# EAGLE design untitled2 (EAGLE 7.2.0)
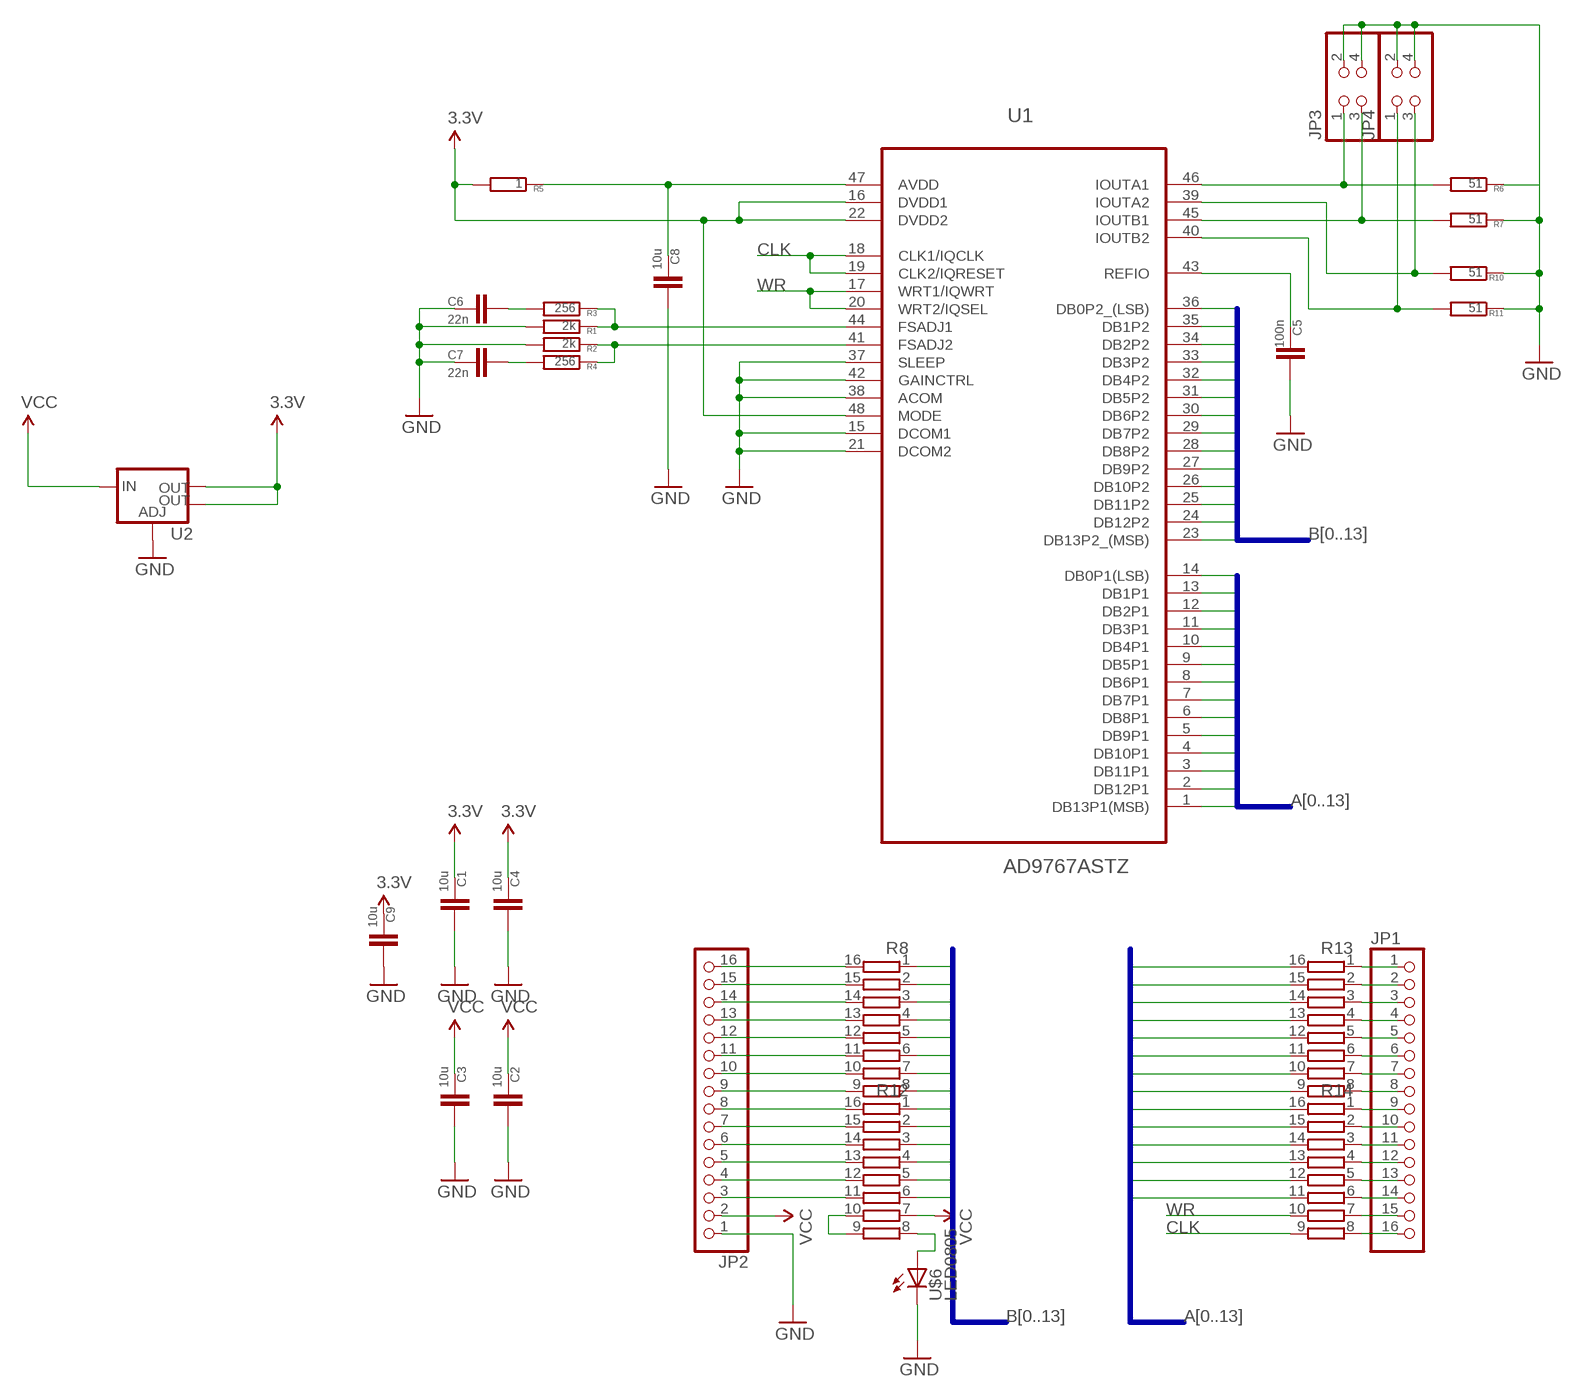
[diagram p0: schematic, sheet 1]

## Parts
C1  10u  CC0805  [C0805]
C2  10u  CC0805  [C0805]
C3  10u  CC0805  [C0805]
C4  10u  CC0805  [C0805]
C5  100n  CC0805  [C0805]
C6  22n  CC0805  [C0805]
C7  22n  CC0805  [C0805]
C8  10u  CC0805  [C0805]
C9  10u  CC0805  [C0805]
JP1  PINHD-1X16_2.54  [1X16]
JP2  PINHD-1X16_2.54  [1X16]
JP3  PINHD-2X02_2.54-SMD  [2X02SMD]
JP4  PINHD-2X02_2.54-SMD  [2X02SMD]
R1  2k  R0805  [R0805]
R2  2k  R0805  [R0805]
R3  256  R0805  [R0805]
R4  256  R0805  [R0805]
R5  1  R0603  [0603]
R6  51  R0805  [R0805]
R7  51  R0805  [R0805]
R8  4816P-T01  [4816P]
R10  51  R0805  [R0805]
R11  51  R0805  [R0805]
R12  4816P-T01  [4816P]
R13  4816P-T01  [4816P]
R14  4816P-T01  [4816P]
U1  AD9767ASTZ  [QFP50P900X900X160-48N]
U2  V_REG_LM1117SOT223  [SOT223]
U$6  LED0805  [0805-LED]

## Nets
3.3V: C1.2 C4.2 C9.2 R5.2 U1.16(DVDD1) U1.22(DVDD2) U1.48(MODE) U2.2(OUT) U2.4(OUT)
A0: R14.11 U1.14(DB0P1(LSB))
A1: R14.12 U1.13(DB1P1)
A2: R14.13 U1.12(DB2P1)
A3: R14.14 U1.11(DB3P1)
A4: R14.15 U1.10(DB4P1)
A5: R14.16 U1.9(DB5P1)
A6: R13.9 U1.8(DB6P1)
A7: R13.10 U1.7(DB7P1)
A8: R13.11 U1.6(DB8P1)
A9: R13.12 U1.5(DB9P1)
A10: R13.13 U1.4(DB10P1)
A11: R13.14 U1.3(DB11P1)
A12: R13.15 U1.2(DB12P1)
A13: R13.16 U1.1(DB13P1(MSB))
B0: R8.1 U1.36(DB0P2_(LSB))
B1: R8.2 U1.35(DB1P2)
B2: R8.3 U1.34(DB2P2)
B3: R8.4 U1.33(DB3P2)
B4: R8.5 U1.32(DB4P2)
B5: R8.6 U1.31(DB5P2)
B6: R8.7 U1.30(DB6P2)
B7: R8.8 U1.29(DB7P2)
B8: R12.1 U1.28(DB8P2)
B9: R12.2 U1.27(DB9P2)
B10: R12.3 U1.26(DB10P2)
B11: R12.4 U1.25(DB11P2)
B12: R12.5 U1.24(DB12P2)
B13: R12.6 U1.23(DB13P2_(MSB))
CLK: R14.9 U1.18(CLK1/IQCLK) U1.19(CLK2/IQRESET)
GND: C1.1 C2.1 C3.1 C4.1 C5.1 C6.2 C7.2 C8.1 C9.1 JP2.1 JP3.2 JP3.4 JP4.2 JP4.4 R1.2 R2.2 R6.1 R7.1 R10.1 R11.1 U1.15(DCOM1) U1.21(DCOM2) U1.37(SLEEP) U1.38(ACOM) U1.42(GAINCTRL) U2.1(ADJ) U$6.C
N$1: JP1.1 R13.1
N$3: JP1.2 R13.2
N$4: JP1.3 R13.3
N$7: JP1.4 R13.4
N$8: JP1.5 R13.5
N$9: JP1.6 R13.6
N$10: C8.2 R5.1 U1.47(AVDD)
N$11: C6.1 R3.2
N$12: C7.1 R4.2
N$13: JP1.7 R13.7
N$15: JP1.8 R13.8
N$16: JP1.9 R14.1
N$17: R1.1 R3.1 U1.44(FSADJ1)
N$18: C5.2 U1.43(REFIO)
N$19: R2.1 R4.1 U1.41(FSADJ2)
N$20: JP1.10 R14.2
N$21: JP1.11 R14.3
N$22: JP1.12 R14.4
N$23: JP1.13 R14.5
N$24: JP1.14 R14.6
N$25: JP1.15 R14.7
N$26: JP1.16 R14.8
N$27: JP2.16 R8.16
N$28: JP2.15 R8.15
N$30: R12.8 U$6.A
N$31: JP2.14 R8.14
N$32: JP2.13 R8.13
N$33: JP2.12 R8.12
N$34: JP2.11 R8.11
N$35: JP2.10 R8.10
N$36: JP2.9 R8.9
N$37: JP2.8 R12.16
N$38: JP2.7 R12.15
N$39: JP2.6 R12.14
N$40: JP2.5 R12.13
N$41: JP2.4 R12.12
N$42: JP2.3 R12.11
N$43: R12.9 R12.10
O1N: JP3.3 R7.2 U1.45(IOUTB1)
O1P: JP3.1 R6.2 U1.46(IOUTA1)
O2N: JP4.1 R11.2 U1.40(IOUTB2)
O2P: JP4.3 R10.2 U1.39(IOUTA2)
VCC: C2.2 C3.2 JP2.2 R12.7 U2.3(IN)
WR: R14.10 U1.17(WRT1/IQWRT) U1.20(WRT2/IQSEL)

## Buses
B[0..13]
A[0..13]

## Library data of the parts
C1-C9 = smalsmd:C: Capacitor
JP1 JP2 = pinhead-2:PINHD-1X16: PIN HEADER
JP3 JP4 = pinhead-2:PINHD-2X02: PIN HEADER
R1-R7 R10 R11 = smalsmd:R
R8 R12-R14 = resistor-bourns:4816P-T01: BOURNS RESISTOR NETWORK; MF: BOURNS, INC.; MPN: 4816P-T01-684LF; OC_FARNELL: 9357483; OC_NEWARK: 33K0707
U1 = Analog Devices_By_element14_Batch_1:AD9767ASTZ: Digital-to-Analog Converter; MPN: AD9767ASTZ; OC_FARNELL: -; OC_NEWARK: 59K7411; PACKAGE: QFP-48; SUPPLIER: ANALOG DEVICES
U2 = SparkFun-PowerIC:V_REG_LM1117: Voltage Regulator LM1117 Standard adjustable voltage regulator but in SMD form. Spark Fun Electronics SKU : COM-00595; PROD_ID: VREG-08170
U$6 = smalsmd:LED

## Board
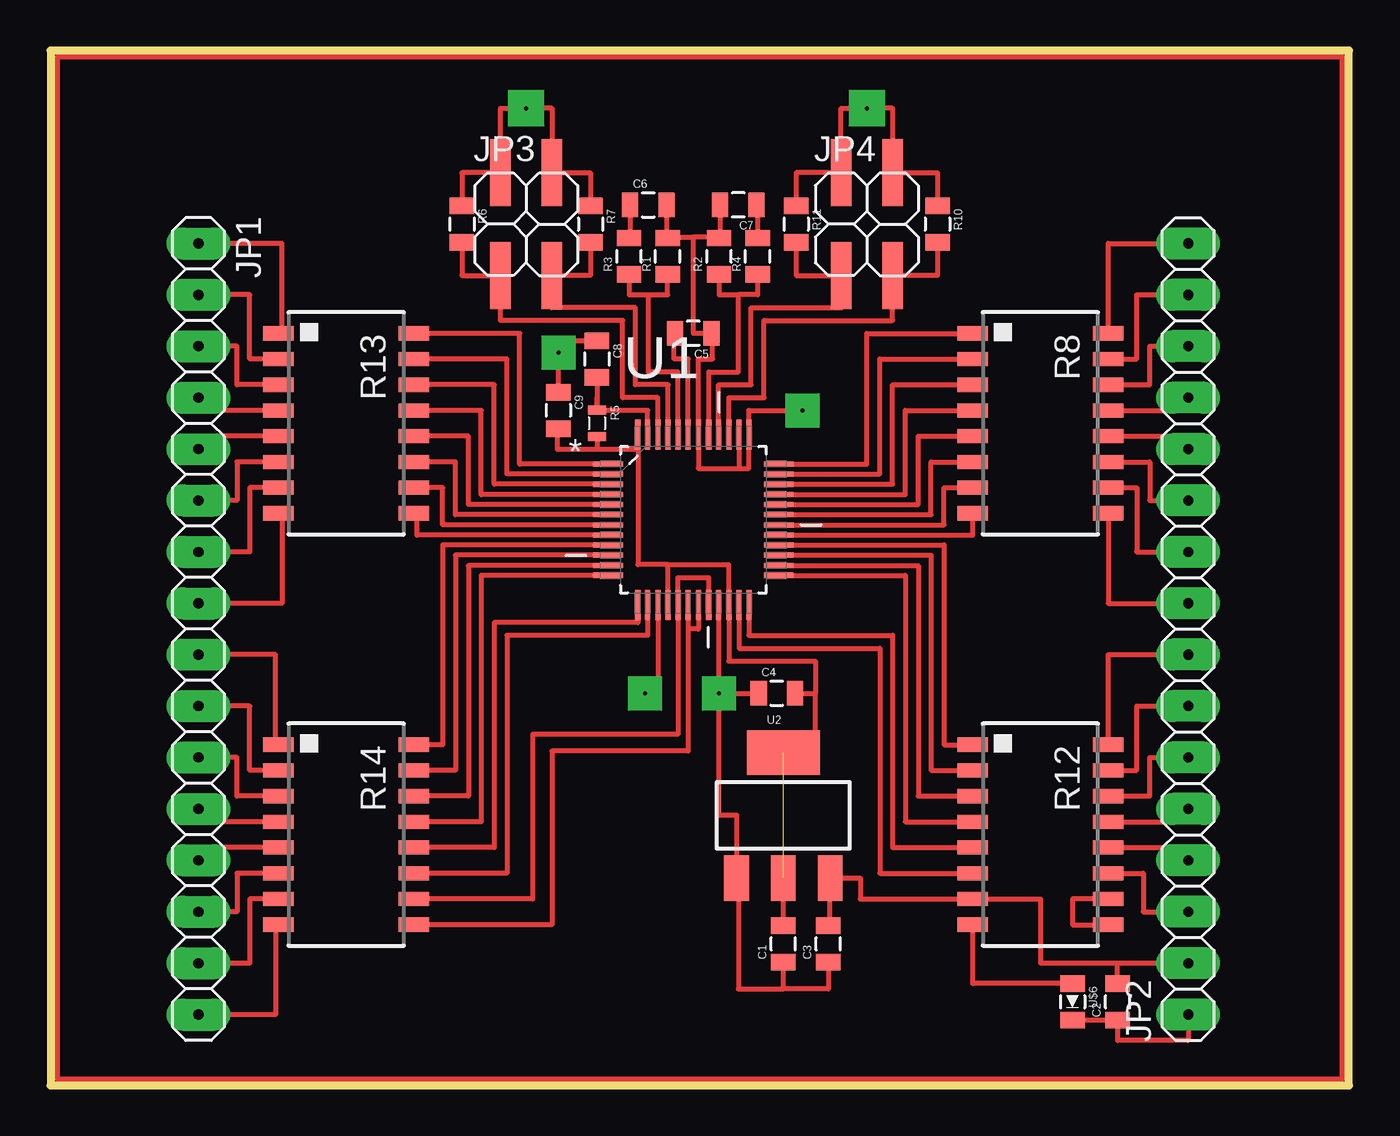
[diagram p1: board, top side]
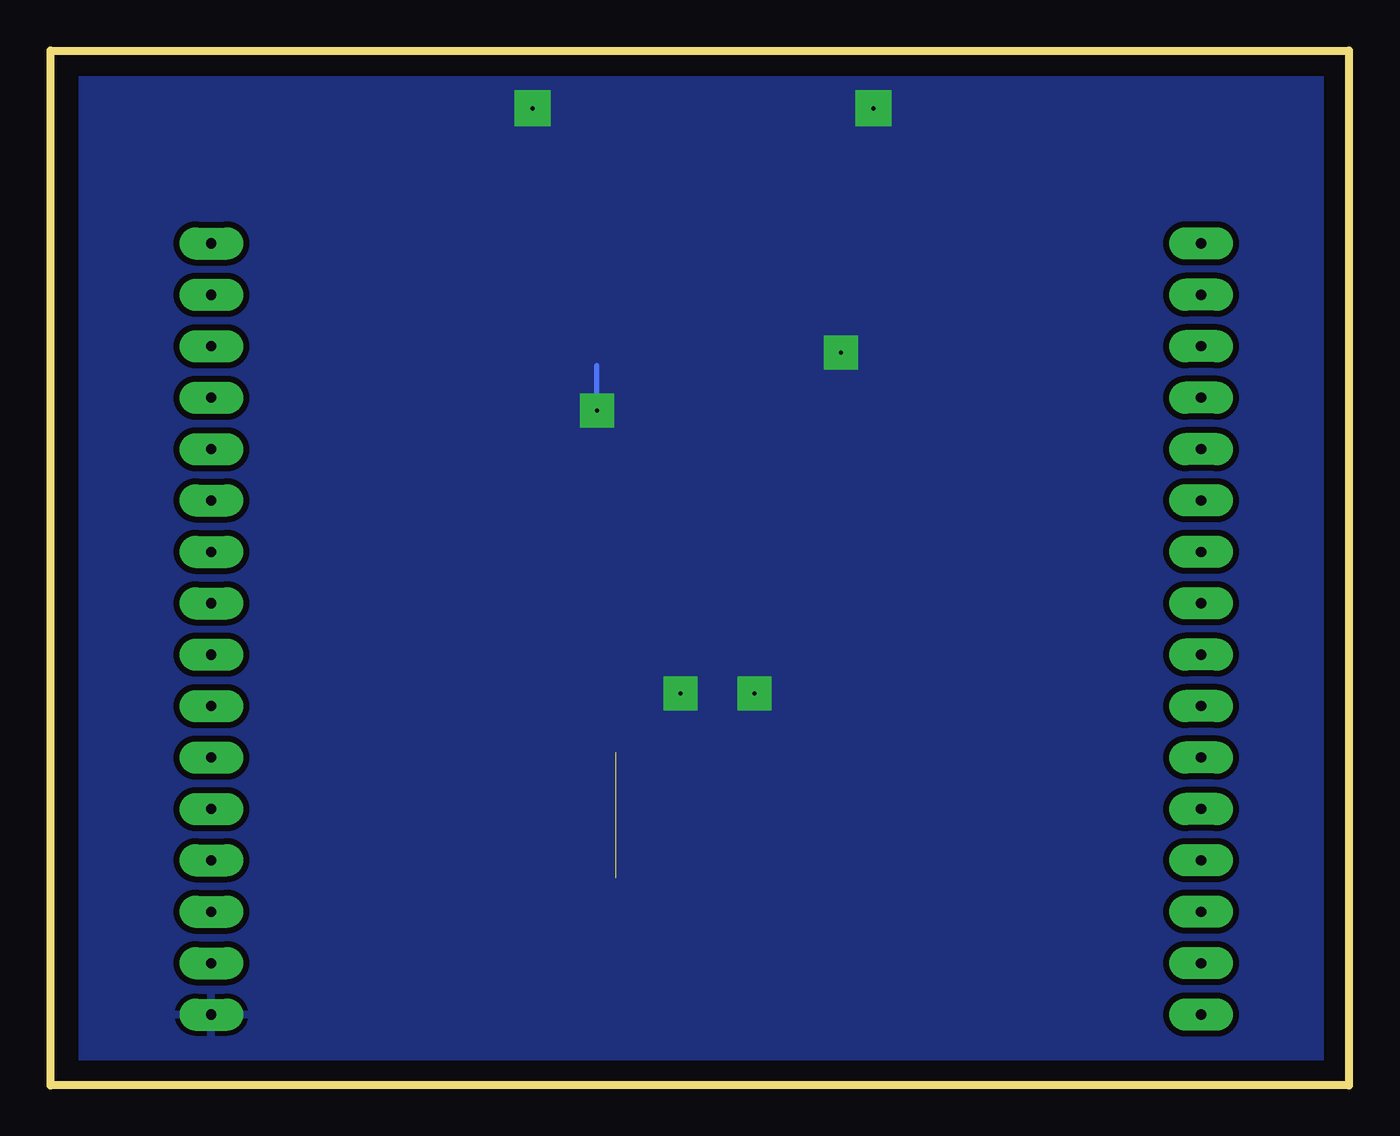
[diagram p2: board, bottom side, seen from below]

Size 64.13 x 51.12 mm. Coordinates in mm from the lower left corner, seen from the top.
Outline: 0,0 64.13,0 64.13,51.12 0,51.12 0,0
Copper layers (1*16): Top 0.035mm / dielectric 1.5mm / Bottom 0.035mm
Design rules "my02": minimum track width 0.2mm, minimum drill 0.2mm, track to track 0.2mm, track to pad 0.2mm, pad to pad 0.2mm, via to via 0.2mm, smd to smd 0.2mm, copper to edge 40mil, drill to drill 8mil, minimum pad ring 10mil, minimum via ring 8mil, stop-mask expansion 4mil, vias tented up to drill 0mil, thermal gap 10mil

### Footprints (pad centres in the part's own frame; a part is rotated, then mirrored left to right if it is on the bottom)
C0805 = smd 0.8 x 1.2: 1 -0.9,0; 2 0.9,0
1X16 = drill 0.5 pad 1.57 long: 1 -19.05,0; 2 -16.51,0; 3 -13.97,0; 4 -11.43,0; 5 -8.89,0; 6 -6.35,0; 7 -3.81,0; 8 -1.27,0; 9 1.27,0; 10 3.81,0; 11 6.35,0; 12 8.89,0; 13 11.43,0; 14 13.97,0; 15 16.51,0; 16 19.05,0
2X02SMD = smd 1.016 x 3.302: 1 -1.27,-3.81; 2 -1.27,1.27; 3 1.27,-3.81; 4 1.27,1.27
R0805 = smd 0.8 x 1.2: 1 -0.9,0; 2 0.9,0
0603 = smd 0.45 x 0.9: 1 -0.65,0; 2 0.65,0
4816P = smd 0.7 x 1.5: 1 -4.445,-3.346; 2 -3.175,-3.346; 3 -1.905,-3.346; 4 -0.635,-3.346; 5 0.635,-3.346; 6 1.905,-3.346; 7 3.175,-3.346; 8 4.445,-3.346; 9 4.445,3.346; 10 3.175,3.346; 11 1.905,3.346; 12 0.635,3.346; 13 -0.635,3.346; 14 -1.905,3.346; 15 -3.175,3.346; 16 -4.445,3.346
QFP50P900X900X160-48N = smd 1.473 x 0.25: 1 -4.216,2.743; 2 -4.216,2.261; 3 -4.216,1.753; 4 -4.216,1.245; 5 -4.216,0.762; 6 -4.216,0.254; 7 -4.216,-0.254; 8 -4.216,-0.762; 9 -4.216,-1.245; 10 -4.216,-1.753; 11 -4.216,-2.261; 12 -4.216,-2.743; 25 4.216,-2.743; 26 4.216,-2.261; 27 4.216,-1.753; 28 4.216,-1.245; 29 4.216,-0.762; 30 4.216,-0.254; 31 4.216,0.254; 32 4.216,0.762; 33 4.216,1.245; 34 4.216,1.753; 35 4.216,2.261; 36 4.216,2.743 | smd 0.25 x 1.473: 13 -2.743,-4.216; 14 -2.261,-4.216; 15 -1.753,-4.216; 16 -1.245,-4.216; 17 -0.762,-4.216; 18 -0.254,-4.216; 19 0.254,-4.216; 20 0.762,-4.216; 21 1.245,-4.216; 22 1.753,-4.216; 23 2.261,-4.216; 24 2.743,-4.216; 37 2.743,4.216; 38 2.261,4.216; 39 1.753,4.216; 40 1.245,4.216; 41 0.762,4.216; 42 0.254,4.216; 43 -0.254,4.216; 44 -0.762,4.216; 45 -1.245,4.216; 46 -1.753,4.216; 47 -2.261,4.216; 48 -2.743,4.216
SOT223 = smd 1.219 x 2.235: 1 -2.311,-3.099; 2 0,-3.099; 3 2.311,-3.099 | smd 3.6 x 2.2: 4 0,3.099
0805-LED = smd 0.8 x 1.2: A -0.9,0; C 0.9,0

### Placement (x,y rotation side)
C1  36.2,6.99 90 top
C2  52.7,4.13 90 top
C3  38.42,6.99 90 top
C4  35.88,19.37 0 top
C5  31.75,37.15 180 top
C6  29.53,43.5 0 top
C7  33.97,43.5 180 top
C8  26.99,35.88 270 top
C9  25.08,33.34 270 top
JP1  7.3,22.54 270 top
JP2  56.2,22.54 90 top
JP3  23.5,43.81 0 top
JP4  40.32,43.81 0 top
R1  30.48,40.96 90 top
R2  33.02,40.96 90 top
R3  28.57,40.96 90 top
R4  34.92,40.96 90 top
R5  26.99,32.7 270 top
R6  20.32,42.55 270 top
R7  26.67,42.55 270 top
R8  48.9,32.7 270 top
R10  43.81,42.55 270 top
R11  36.83,42.55 270 top
R12  48.9,12.38 270 top
R13  14.61,32.7 270 top
R14  14.61,12.38 270 top
U1  31.75,27.94 0 top
U2  36.2,13.34 0 top
U$6  50.48,4.13 270 top

### Tracks (layer width: path | path; a pad name or v marks a point on that pad's centre or on a via)
3.3V  (1 unrouted)
  Top 0.254: U1.16 30.51,25.72 | 30.51,25.72 33.5,25.72 U1.22 33.5,20.96 37.78,20.96 37.78,19.37 | 30.51,25.72 29.01,25.72 29.01,31.43 | U1.48 29.01,31.43 | 26.99,31.43 29.01,31.43 | R5.2 26.99,31.43 | 26.99,31.43 25.03,31.43 25.03,32.44 C9.2 | C4.2 37.78,19.37 | U2.4 37.78,16.43 37.78,19.37 | C1.2 U2.2
A0
  Top 0.254: U1.14 29.49,22.23 22.54,22.23 22.54,10.48 R14.11
A1
  Top 0.254: R14.12 21.91,11.75 21.91,22.86 29.01,22.86 U1.13
A2
  Top 0.254: U1.12 21.27,25.2 21.27,13.02 R14.13
A3
  Top 0.254: U1.11 20.64,25.68 20.64,14.29 R14.14
A4
  Top 0.254: U1.10 20,26.19 20,15.56 R14.15
A5
  Top 0.254: U1.9 19.37,26.7 19.37,16.83 R14.16
A6
  Top 0.254: U1.8 18.1,27.18 18.1,28.26 R13.9
A7
  Top 0.254: U1.7 19.37,27.69 19.37,29.53 R13.10
A8
  Top 0.254: U1.6 20,28.19 20,30.8 R13.11
A9
  Top 0.254: U1.5 20.64,28.7 20.64,32.07 R13.12
A10
  Top 0.254: U1.4 21.27,29.19 21.27,33.34 R13.13
A11
  Top 0.254: U1.3 21.91,29.69 21.91,34.61 R13.14
A12
  Top 0.254: 17.78,35.88 R13.15 22.54,35.88 22.54,30.2 U1.2
A13
  Top 0.254: U1.1 23.18,30.68 23.18,37.15 R13.16
B0
  Top 0.254: U1.36 40.32,30.68 40.32,37.15 R8.1
B1
  Top 0.254: U1.35 40.96,30.2 40.96,35.88 R8.2
B2
  Top 0.254: U1.34 41.59,29.69 41.59,34.61 R8.3
B3
  Top 0.254: U1.33 42.23,29.19 42.23,33.34 R8.4
B4
  Top 0.254: U1.32 42.86,28.7 42.86,32.07 R8.5
B5
  Top 0.254: U1.31 43.5,28.19 43.5,30.8 R8.6
B6
  Top 0.254: U1.30 44.13,27.69 44.13,29.53 R8.7
B7
  Top 0.254: U1.29 45.55,27.18 R8.8
B8
  Top 0.254: U1.28 44.13,26.7 44.13,16.83 R12.1
B9
  Top 0.254: U1.27 43.5,26.19 43.5,15.56 R12.2
B10
  Top 0.254: U1.26 42.86,25.68 42.86,14.29 R12.3
B11
  Top 0.254: U1.25 42.23,25.2 42.23,13.02 R12.4
B12
  Top 0.254: U1.24 34.49,22.23 41.59,22.23 41.59,11.75 R12.5
B13
  Top 0.254: U1.23 34.01,21.59 40.96,21.59 40.96,10.48 R12.6
CLK
  Top 0.254: U1.18 31.5,22.54 | 31.5,22.54 31.5,16.51 24.76,16.51 24.76,7.94 R14.9 | U1.19 32,22.54 31.5,22.54
GND  (via drill 0.2 pad 1.68, 0.2 pad 1.78)
  Top 0.254: JP2.1 56.2,2.22 52.7,2.22 C2.1 U$6.C | 34.01,30.48 32,30.48 U1.42 32,35.88 32.7,35.88 32.7,37.15 | U1.38 34.01,30.48 | C5.1 32.7,37.47 32.7,37.15 | 32.7,37.15 31.75,37.15 31.75,41.91 | 31.75,41.91 30.48,41.91 R1.2 30.43,41.86 C6.2 | 31.75,41.91 33.02,41.91 R2.2 33.07,41.86 C7.2 | 34.01,30.48 34.49,30.48 U1.37 34.49,33.34 v37.15,33.34 | R6.1 20.32,45.09 JP3.2 22.23,48.26 v23.5,48.26 24.76,48.26 JP3.4 26.67,45.09 R7.1 | R11.1 36.83,45.09 JP4.2 39.05,48.26 v40.32,48.26 41.59,48.26 JP4.4 43.81,45.09 R10.1 | U1.15 30,19.69 v29.36,19.37 | 25.14,36.51 v25.08,36.2 | C8.1 25.08,36.78 v25.08,36.2 | C9.1 v25.08,36.2 | C3.1 38.42,4.76 36.19,4.76 | 36.19,4.76 C1.1 | 36.19,4.76 33.97,4.76 33.97,10.24 U2.1 33.88,13.34 33.02,13.34 v33.02,19.37 | v33.02,19.37 C4.1 | U1.21 32.99,19.37 v33.02,19.37
  Bottom 0.254: v29.36,19.37 28.89,19.37 | v25.08,36.2 24.76,35.88 | v37.15,33.34 37.15,35.56 | v23.5,48.26 23.18,48.26 | v40.32,48.26 39.69,48.26 | v33.02,19.37 33.02,18.73
  pour Bottom (isolate 0.305, rank 6): 1.27,1.27 62.55,0.95 62.55,50.16 1.27,50.16
N$1
  Top 0.254: R13.1 11.43,37.15 11.43,41.59 JP1.1
N$3
  Top 0.254: R13.2 9.84,35.88 9.84,39.05 JP1.2
N$4
  Top 0.254: R13.3 9.21,34.61 9.21,36.51 JP1.3
N$7
  Top 0.254: R13.4 7.3,33.34 JP1.4
N$8
  Top 0.254: R13.5 7.3,32.07 JP1.5
N$9
  Top 0.254: R13.6 9.21,30.8 9.21,28.89 JP1.6
N$10
  Top 0.254: U1.47 29.49,33.34 | 29.49,33.35 29.49,33.34 | 29.49,33.34 26.99,33.34 R5.1 | R5.1 26.99,33.97 | C8.2 R5.1
N$11
  Top 0.254: C6.1 28.63,41.86 R3.2
N$12
  Top 0.254: C7.1 34.87,43.18 34.92,43.18 R4.2
N$13
  Top 0.254: R13.7 9.84,29.53 9.84,26.35 JP1.7
N$15
  Top 0.254: R13.8 11.43,28.26 11.43,23.81 JP1.8
N$16
  Top 0.254: R14.1 11.11,16.83 11.11,21.27 JP1.9
N$17
  Top 0.254: U1.44 30.99,35.24 29.53,35.24 29.53,39.05 | R3.1 28.57,39.05 29.53,39.05 | 29.53,39.05 30.48,39.05 R1.1
N$18
  Top 0.254: U1.43 31.5,35.88 30.8,35.88 30.8,37.47 C5.2
N$19
  Top 0.254: U1.41 32.51,35.24 33.97,35.24 33.97,39.05 | R2.1 33.02,39.05 33.97,39.05 | R4.1 34.92,39.05 33.97,39.05
N$20
  Top 0.254: R14.2 9.84,15.56 9.84,18.73 JP1.10
N$21
  Top 0.254: R14.3 9.21,14.29 9.21,16.19 JP1.11
N$22
  Top 0.254: R14.4 7.3,13.02 JP1.12
N$23
  Top 0.254: R14.5 7.3,11.75 JP1.13
N$24
  Top 0.254: R14.6 9.21,10.48 9.21,8.57 JP1.14
N$25
  Top 0.254: R14.7 9.84,9.21 9.84,6.03 JP1.15
N$26
  Top 0.254: R14.8 11.11,7.94 11.11,3.49 JP1.16
N$27
  Top 0.254: R8.16 52.24,41.59 JP2.16
N$28
  Top 0.254: R8.15 53.66,35.88 53.66,39.05 JP2.15
N$29
  Top 0.254: 0.32,0.32 63.82,0.32 63.82,50.8 0.32,50.8 0.32,0.32
N$30
  Top 0.254: U$6.A 45.55,5.03 R12.8
N$31
  Top 0.254: R8.14 54.29,34.61 54.29,36.51 JP2.14
N$32
  Top 0.254: R8.13 56.2,33.34 JP2.13
N$33
  Top 0.254: R8.12 56.2,32.07 JP2.12
N$34
  Top 0.254: R8.11 54.29,30.8 54.29,28.89 JP2.11
N$35
  Top 0.254: R8.10 53.66,29.53 53.66,26.35 JP2.10
N$36
  Top 0.254: R8.9 52.24,23.81 JP2.9
N$37
  Top 0.254: R12.16 52.24,21.27 JP2.8
N$38
  Top 0.254: R12.15 53.66,15.56 53.66,18.73 JP2.7
N$39
  Top 0.254: R12.14 54.29,14.29 54.29,16.19 JP2.6
N$40
  Top 0.254: R12.13 56.2,13.02 JP2.5
N$41
  Top 0.254: R12.12 56.2,11.75 JP2.4
N$42
  Top 0.254: R12.11 53.98,10.48 53.98,8.57 JP2.3
N$43
  Top 0.254: R12.10 50.48,9.21 50.48,7.94 R12.9
O1N
  Top 0.254: U1.45 30.51,34.61 28.89,34.61 28.89,38.42 24.76,38.42 JP3.3 26.67,40.01 R7.2
O1P
  Top 0.254: U1.46 30,33.97 28.26,33.97 28.26,37.78 22.23,37.78 JP3.1 20.32,40.01 R6.2
O2N
  Top 0.254: U1.40 32.99,34.61 34.61,34.61 34.61,38.42 39.05,38.42 JP4.1 36.83,40.01 R11.2
O2P
  Top 0.254: U1.39 33.5,33.97 35.24,33.97 35.24,37.78 41.59,37.78 JP4.3 43.81,40.01 R10.2
VCC
  Top 0.254: JP2.2 52.7,6.03 | 52.7,6.03 48.9,6.03 48.9,9.21 R12.7 40.01,9.21 40.01,10.24 U2.3 38.51,7.89 C3.2 | C2.2 52.7,6.03
WR
  Top 0.254: U1.20 32.51,25.08 30.99,25.08 U1.17 30.99,17.34 23.81,17.34 23.81,9.21 R14.10